# Altium schematic sheet Accerelometer.SchDoc: Accelerometer (MMA8452Q) circuit
size A4; Revision: 1-1; SheetNumber: 4; SheetTotal: 6
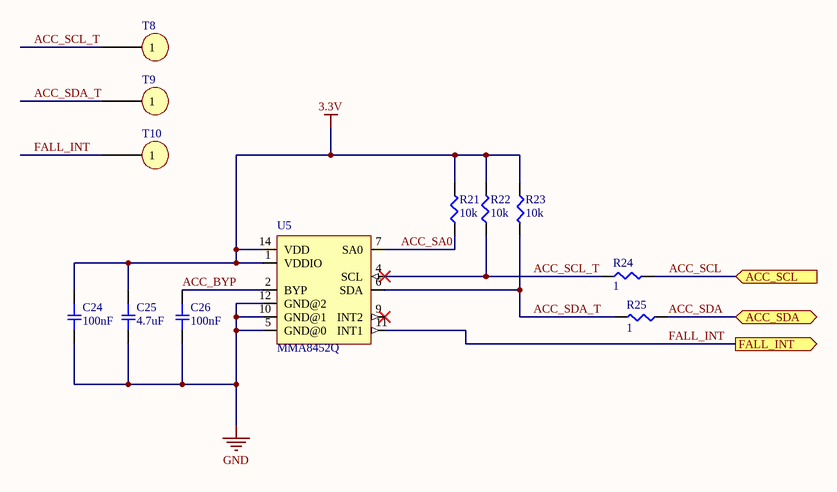
[diagram p0: Accerelometer.SchDoc]

## Parts
C24  value 100nF  [0603-CAP]  (hidden comment: 0603C 100NF)
C25  value 4.7uF  [0603-CAP]  (hidden comment: 0603C 4U7F)
C26  value 100nF  [0603-CAP]  (hidden comment: 0603C 100NF)
R21  value 10k  [0603-RES]  (hidden comment: 0603R 10KR)
R22  value 10k  [0603-RES]  (hidden comment: 0603R 10KR)
R23  value 10k  [0603-RES]  (hidden comment: 0603R 10KR)
R24  value 1  [0603-RES]  (hidden comment: 0603R 1R)
R25  value 1  [0603-RES]  (hidden comment: 0603R 1R)
T8  1pin_test  [1_PIN_test]  (value not drawn)
T9  1pin_test  [1_PIN_test]  (value not drawn)
T10  1pin_test  [1_PIN_test]  (value not drawn)
U5  MMA8452Q  [*QFN-16_0.5MM]

## Ports
ACC_SCL (in), ACC_SDA (bidir), FALL_INT (out)

## Nets
3.3V: C24.1 C25.1 R21.2 R22.2 R23.1 U5.1(VDDIO) U5.14(VDD)
GND: C24.2 C25.2 C26.2 U5.5(GND@0) U5.10(GND@1) U5.12(GND@2)
ACC_BYP: C26.1 U5.2(BYP)
ACC_SA0: R21.1 U5.7(SA0)
ACC_SCL: R24.2 ; port ACC_SCL
ACC_SCL_T: R22.1 R24.1 T8.1 U5.4(SCL)
ACC_SDA: R25.1 ; port ACC_SDA
ACC_SDA_T: R23.2 R25.2 T9.1 U5.6(SDA)
FALL_INT: T10.1 U5.11(INT1) ; port FALL_INT

Not connected (* = marked no-connect by the designer): U5 9(INT2)*

## Notes on the sheet
- Title
- Size:
- Date:
- A4
- Number:
- Time:
- Revision:
- Sheet
- of
- File:

## Library data of the parts
U5 = MMA8452Q: Accelerometer X, Y, Z Axis , 2g, 4g, 8g 0.78Hz ~ 400Hz 16-QFN _3x3_; MP: MMA8452QR1; MF: NXP Semiconductors; Price: 1.147; Package: 16-VFQFN; Availability: Unavailable; SnapEDA_Link: https://www.snapeda.com/parts/MMA8452Q/NXP%20Semiconductors/view-part/4219708/?ref=snap; Value: *; Digikey link: https://www.digikey.com/product-detail/en/nxp-usa-inc/MMA8452QR1/MMA8452QR1TR-ND/2508917; Datasheet link: https://www.nxp.com/docs/en/data-sheet/MMA8451Q.pdf; Supplier 1: Digi-Key; Supplier Part Number 1: MMA8452QR1CT-ND
C24 C26 = 0603C 100NF: Supplier 1: Digi-Key; Supplier Part Number 1: 490-8020-1-ND
C25 = 0603C 4U7F: Supplier 1: Digi-Key; Supplier Part Number 1: 399-3482-1-ND
R21-R23 = 0603R 10KR: Package: 0603; Supplier 1: Digi-Key; Supplier Part Number 1: 311-10.0KHRCT-ND
R24 R25 = 0603R 1R: Package: 0603; Supplier 1: Digi-Key; Supplier Part Number 1: 311-1.00HRCT-ND